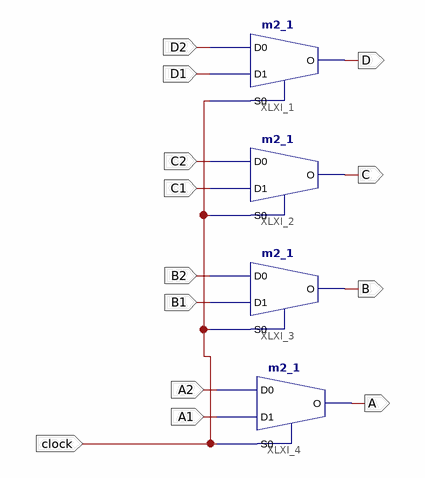
[diagram p0: schematic sheet 1]
// Xilinx ISE schematic Mux8_4.sch (spartan6) as structural Verilog: 4 symbols, 13 ports
module Mux8_4 (
  input  D2,
  input  D1,
  input  C2,
  input  C1,
  input  B2,
  input  B1,
  input  A2,
  input  A1,
  input  clock,
  output D,
  output C,
  output B,
  output A
);

  m2_1 XLXI_1 (.D0(D2), .D1(D1), .S0(clock), .O(D));
  m2_1 XLXI_2 (.D0(C2), .D1(C1), .S0(clock), .O(C));
  m2_1 XLXI_3 (.D0(B2), .D1(B1), .S0(clock), .O(B));
  m2_1 XLXI_4 (.D0(A2), .D1(A1), .S0(clock), .O(A));
endmodule
